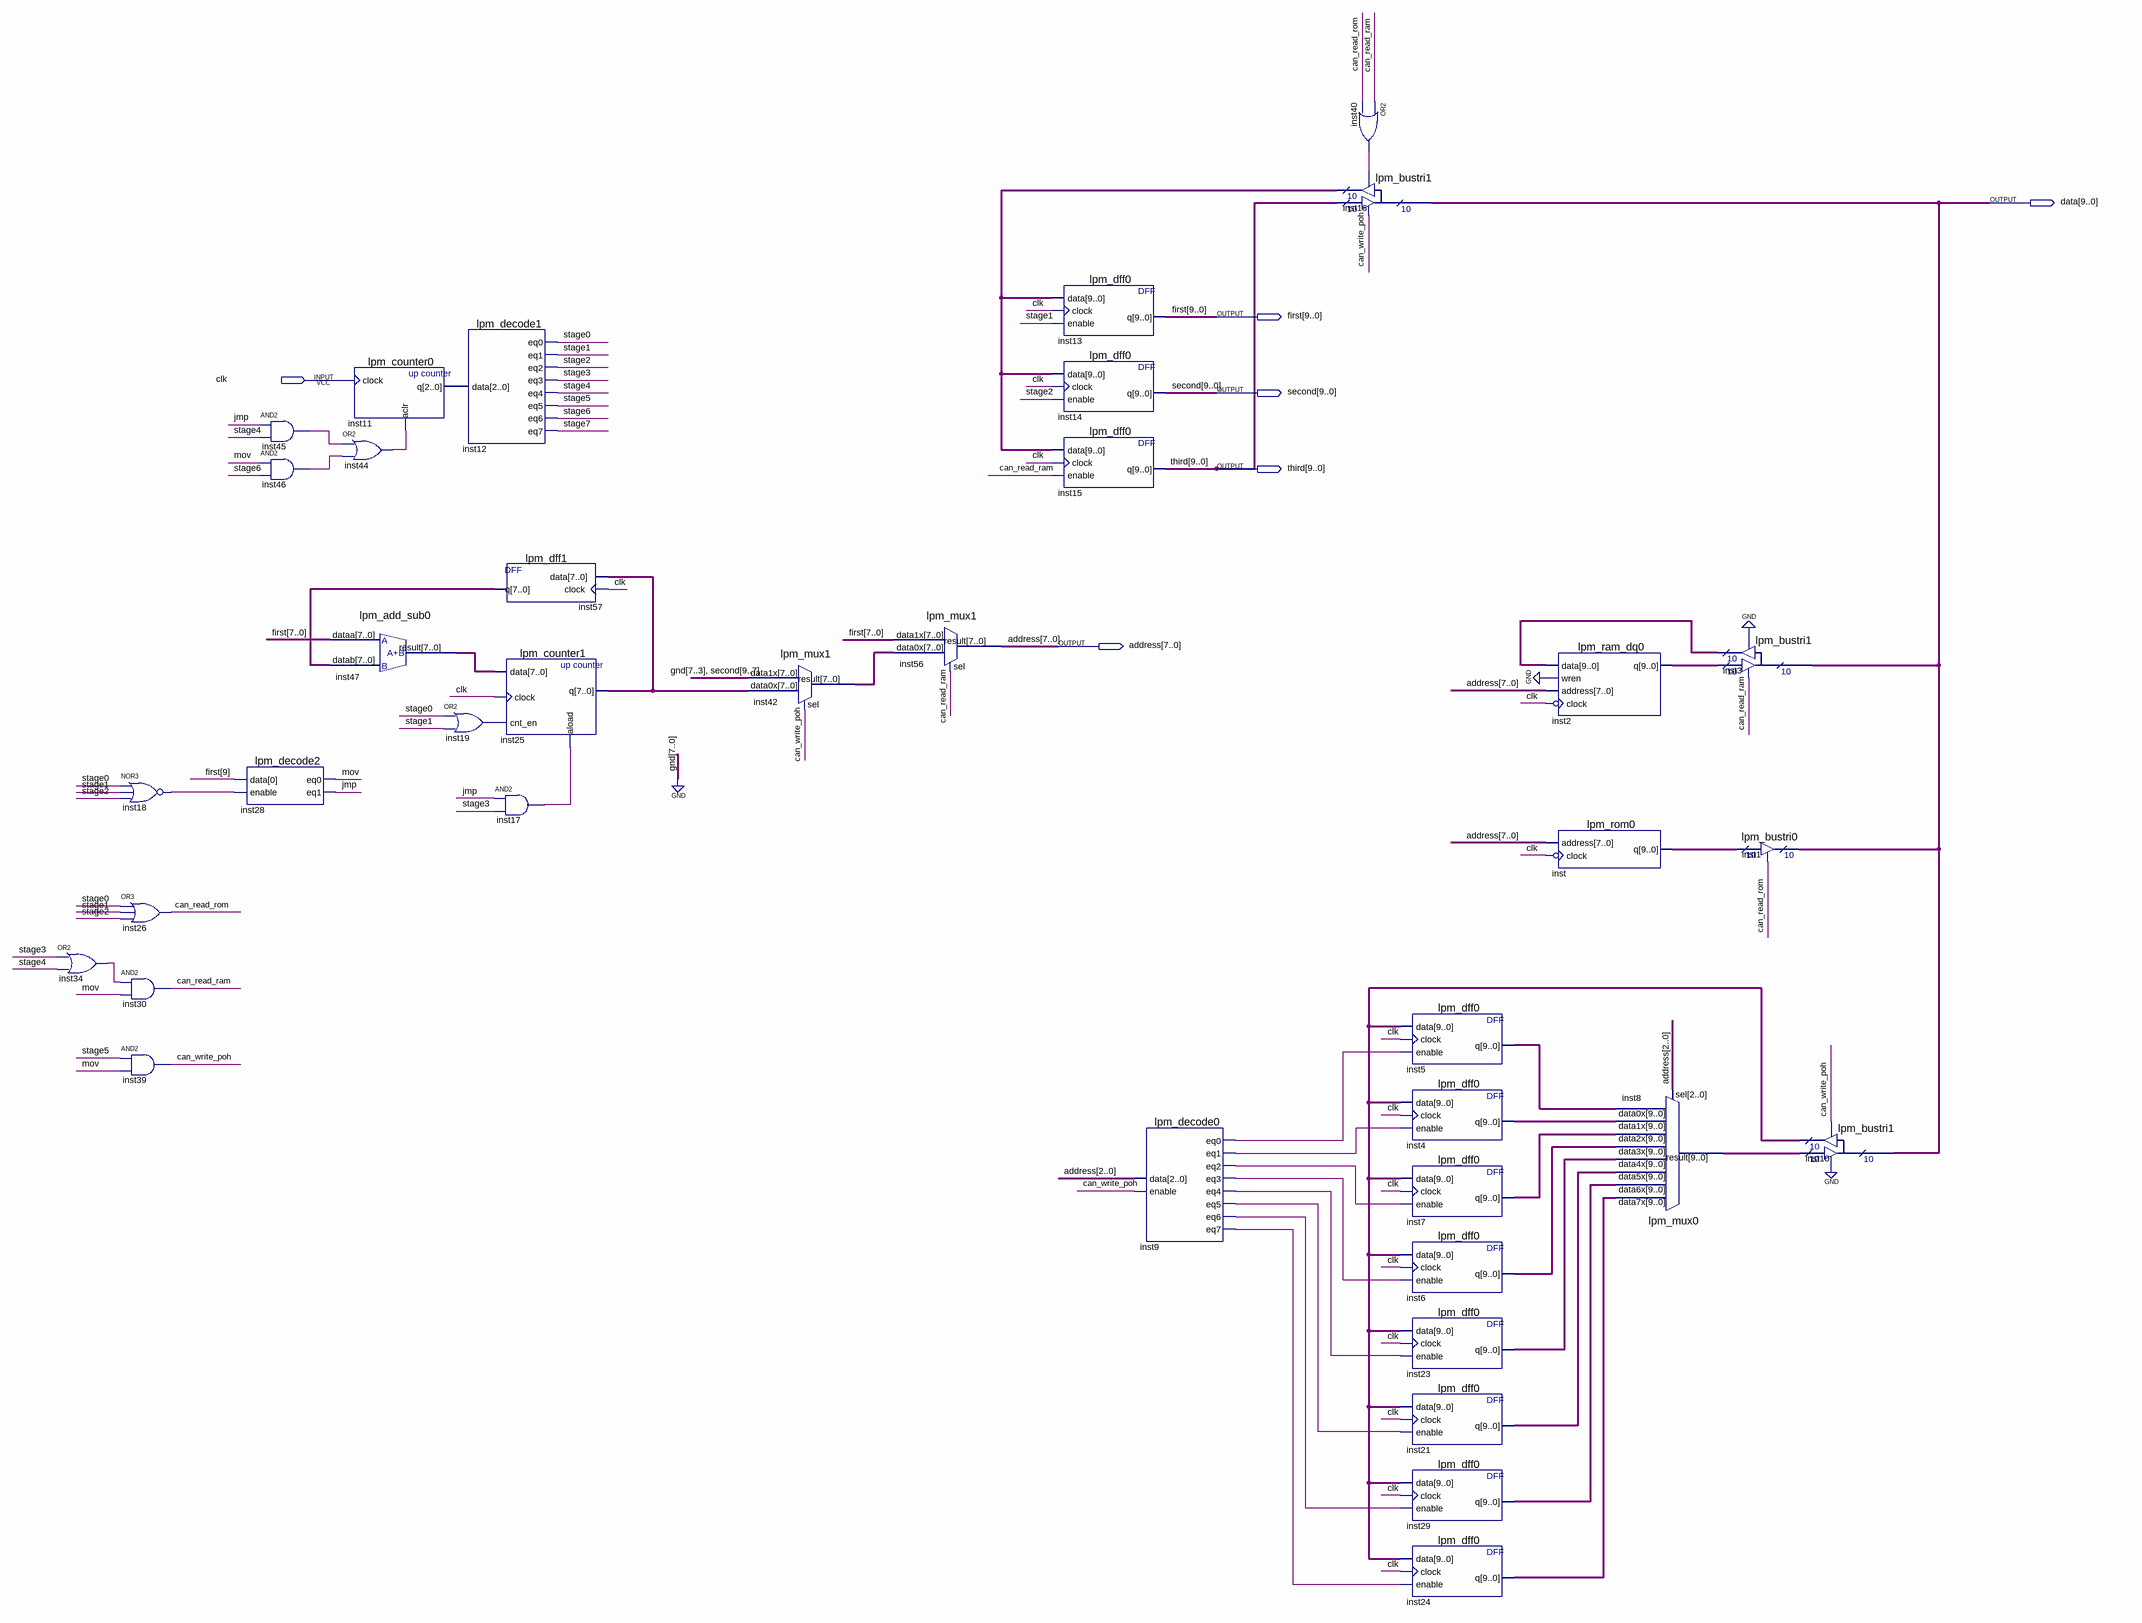
[diagram p0: schematic sheet]
// Quartus schematic Lab4.bdf as structural Verilog: 38 symbols, 6 pins
module Lab4 (
  input  clk,
  output [9:0] data,
  output [9:0] first,
  output [9:0] second,
  output [9:0] third,
  output [7:0] address
);

  wire can_read_ram, can_read_rom, can_write_poh, inst9_eq0, inst9_eq1, inst9_eq2, inst9_eq3, inst9_eq4,
       inst9_eq5, inst9_eq6, inst9_eq7, inst17_out, inst18_out, inst19_out, inst34_out, inst40_out,
       inst44_out, inst45_out, inst46_out, jmp, mov, stage0, stage1, stage2, stage3, stage4, stage5, stage6,
       stage7;
  wire [2:0] inst11_q;
  wire [7:0] inst25_q, inst42_result, inst47_result, inst57_q;
  wire [9:0] inst2_q, inst3_result, inst4_q, inst5_q, inst6_q, inst7_q, inst8_result, inst10_result,
       inst16_result, inst21_q, inst23_q, inst24_q, inst29_q, inst_q;

  or inst34 (inst34_out, stage3, stage4);
  nor inst18 (inst18_out, stage0, stage1, stage2);
  or inst26 (can_read_rom, stage0, stage1, stage2);
  and inst30 (can_read_ram, inst34_out, mov);
  and inst39 (can_write_poh, stage5, mov);
  lpm_decode2 inst28 (.data(first[9]), .enable(inst18_out), .eq0(mov), .eq1(jmp));
  and inst45 (inst45_out, jmp, stage4);
  and inst46 (inst46_out, mov, stage6);
  lpm_counter0 inst11 (.clock(clk), .aclr(inst44_out), .q(inst11_q));
  or inst44 (inst44_out, inst45_out, inst46_out);
  lpm_add_sub0 inst47 (.dataa(first[7:0]), .datab(inst57_q), .result(inst47_result));
  lpm_decode1 inst12 (
    .data(inst11_q), .eq0(stage0), .eq1(stage1), .eq2(stage2), .eq3(stage3), .eq4(stage4), .eq5(stage5),
    .eq6(stage6), .eq7(stage7));
  or inst19 (inst19_out, stage0, stage1);
  lpm_dff1 inst57 (.data(inst25_q), .clock(clk), .q(inst57_q));
  lpm_counter1 inst25 (.data(inst47_result), .clock(clk), .cnt_en(inst19_out), .aload(inst17_out), .q(inst25_q));
  and inst17 (inst17_out, jmp, stage3);
  lpm_mux1 inst42 (.data1x({{5{1'b0}}, second[9:7]}), .data0x(inst25_q), .sel(can_write_poh), .result(inst42_result));
  lpm_mux1 inst56 (.data1x(first[7:0]), .data0x(inst42_result), .sel(can_read_ram), .result(address));
  lpm_dff0 inst13 (.data(inst16_result), .clock(clk), .enable(stage1), .q(first));
  lpm_dff0 inst14 (.data(inst16_result), .clock(clk), .enable(stage2), .q(second));
  lpm_dff0 inst15 (.data(inst16_result), .clock(clk), .enable(can_read_ram), .q(third));
  lpm_decode0 inst9 (
    .data(address[2:0]), .enable(can_write_poh), .eq0(inst9_eq0), .eq1(inst9_eq1), .eq2(inst9_eq2),
    .eq3(inst9_eq3), .eq4(inst9_eq4), .eq5(inst9_eq5), .eq6(inst9_eq6), .eq7(inst9_eq7));
  or inst40 (inst40_out, can_read_ram, can_read_rom);
  lpm_bustri1 inst16 (
    .enabledt(can_write_poh), .data(third), .enabletr(inst40_out), .result(inst16_result), .tridata(data));
  lpm_dff0 inst5 (.data(inst10_result), .clock(clk), .enable(inst9_eq0), .q(inst5_q));
  lpm_dff0 inst4 (.data(inst10_result), .clock(clk), .enable(inst9_eq1), .q(inst4_q));
  lpm_dff0 inst7 (.data(inst10_result), .clock(clk), .enable(inst9_eq2), .q(inst7_q));
  lpm_dff0 inst6 (.data(inst10_result), .clock(clk), .enable(inst9_eq3), .q(inst6_q));
  lpm_dff0 inst23 (.data(inst10_result), .clock(clk), .enable(inst9_eq4), .q(inst23_q));
  lpm_dff0 inst21 (.data(inst10_result), .clock(clk), .enable(inst9_eq5), .q(inst21_q));
  lpm_dff0 inst29 (.data(inst10_result), .clock(clk), .enable(inst9_eq6), .q(inst29_q));
  lpm_dff0 inst24 (.data(inst10_result), .clock(clk), .enable(inst9_eq7), .q(inst24_q));
  lpm_ram_dq0 inst2 (.data(inst3_result), .wren(1'b0), .address(address), .clock(~clk), .q(inst2_q));
  lpm_rom0 inst (.address(address), .clock(~clk), .q(inst_q));
  lpm_mux0 inst8 (
    .data7x(inst24_q), .data6x(inst29_q), .data5x(inst21_q), .data4x(inst23_q), .data3x(inst6_q),
    .data2x(inst7_q), .data1x(inst4_q), .data0x(inst5_q), .sel(address[2:0]), .result(inst8_result));
  lpm_bustri1 inst3 (.enabledt(can_read_ram), .data(inst2_q), .enabletr(1'b0), .result(inst3_result), .tridata(data));
  lpm_bustri0 inst1 (.enabledt(can_read_rom), .data(inst_q), .tridata(data));
  lpm_bustri1 inst10 (
    .enabledt(1'b0), .data(inst8_result), .enabletr(can_write_poh), .result(inst10_result), .tridata(data));
endmodule
